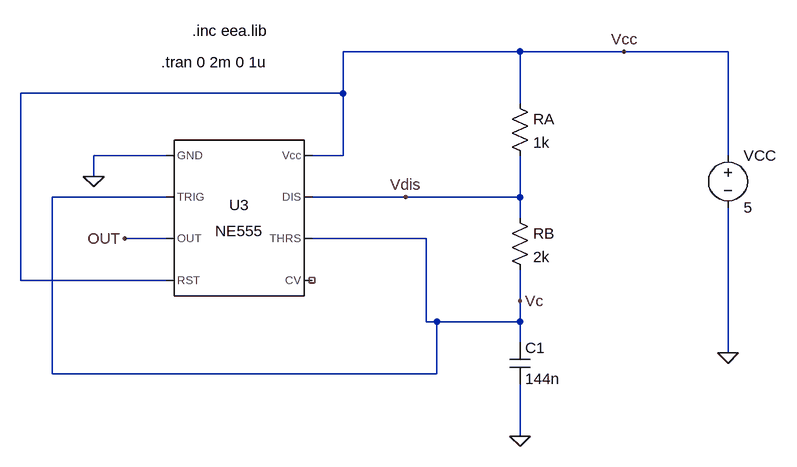
[diagram p0: schematic STI_TC1_Auto_4-NE55.asc]
STI_TC1_Auto_4-NE55.asc, the LTspice schematic file:
Version 4
SHEET 1 1064 788
WIRE 640 112 368 112
WIRE 800 112 640 112
WIRE 960 112 800 112
WIRE 368 176 368 112
WIRE 368 176 -128 176
WIRE 640 192 640 112
WIRE 96 272 -16 272
WIRE 368 272 368 176
WIRE 368 272 320 272
WIRE 960 272 960 112
WIRE -16 304 -16 272
WIRE 96 336 -80 336
WIRE 464 336 320 336
WIRE 640 336 640 272
WIRE 640 336 464 336
WIRE 640 368 640 336
WIRE 96 400 32 400
WIRE 496 400 320 400
WIRE -128 464 -128 176
WIRE 96 464 -128 464
WIRE 640 496 640 448
WIRE 496 528 496 400
WIRE 512 528 496 528
WIRE 640 528 640 496
WIRE 640 528 512 528
WIRE 640 560 640 528
WIRE 960 576 960 352
WIRE -80 608 -80 336
WIRE 512 608 512 528
WIRE 512 608 -80 608
WIRE 640 704 640 624
FLAG -16 304 0
FLAG 960 576 0
FLAG 640 704 0
FLAG 32 400 OUT
FLAG 800 112 Vcc
FLAG 640 496 Vc
FLAG 464 336 Vdis
SYMBOL Misc\\NE555 208 368 R0
SYMATTR InstName U3
SYMBOL res 624 176 R0
SYMATTR InstName RA
SYMATTR Value 1k
SYMBOL res 624 352 R0
SYMATTR InstName RB
SYMATTR Value 2k
SYMBOL voltage 960 256 R0
WINDOW 123 0 0 Left 0
WINDOW 39 0 0 Left 0
SYMATTR InstName VCC
SYMATTR Value 5
SYMBOL cap 624 560 R0
SYMATTR InstName C1
SYMATTR Value 144n
TEXT 136 80 Left 2 !.inc eea.lib
TEXT 88 128 Left 2 !.tran 0 2m 0 1u

The netlist it stands for:
* STI_TC1_Auto_4-NE55.asc
XU3 0 Vc OUT Vcc NC_01 Vc Vdis Vcc NE555  ; pins GND TRIG OUT RST CV THRS DIS Vcc
RA Vcc Vdis 1k
RB Vdis Vc 2k
VCC Vcc 0 5
C1 Vc 0 144n
.inc eea.lib
.tran 0 2m 0 1u
.lib NE555.sub
.backanno
.end

* Results of the author's LTspice run, read from the files saved beside the schematic
* Operating Point, zero values left out:
*   V(vc) = 5 V
*   V(vcc) = 5 V
*   V(vdis) = 5 V
*   V(out) = 5 V
*   I(Rb) = 10 nA
*   I(Ra) = 16.67 nA
*   I(Vcc) = -1.611 mA
*   Ix(u3:1) = -1.611 mA
*   Ix(u3:2) = 5 nA
*   Ix(u3:4) = 22.67 µA
*   Ix(u3:6) = 5 nA
*   Ix(u3:7) = 6.672 nA
*   Ix(u3:8) = 1.588 mA
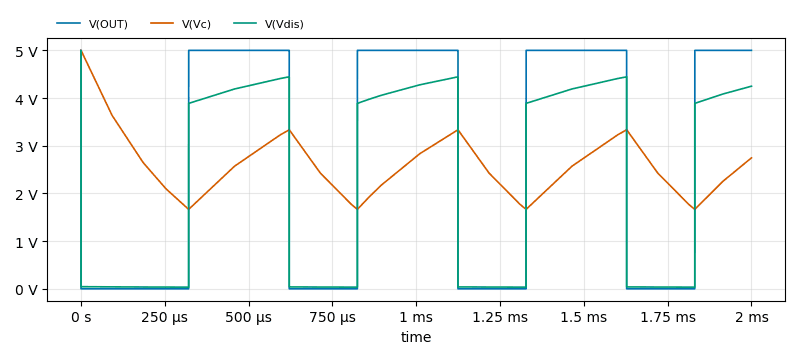
[diagram p1: Transient Analysis of STI_TC1_Auto_4-NE55.asc, plotted from the saved traces]
* Transient Analysis, 1 run:
*   V(OUT): min 30 µV, max 5 V, average 2.672 V, rms 3.655 V, last 5 V
*   V(Vc): min 1.665 V, max 5 V, average 2.578 V, rms 2.67 V, last 2.745 V
*   V(Vdis): min 34.68 mV, max 5 V, average 2.25 V, rms 3.056 V, last 4.248 V